# Altium project Parking_PCB.PrjPcb
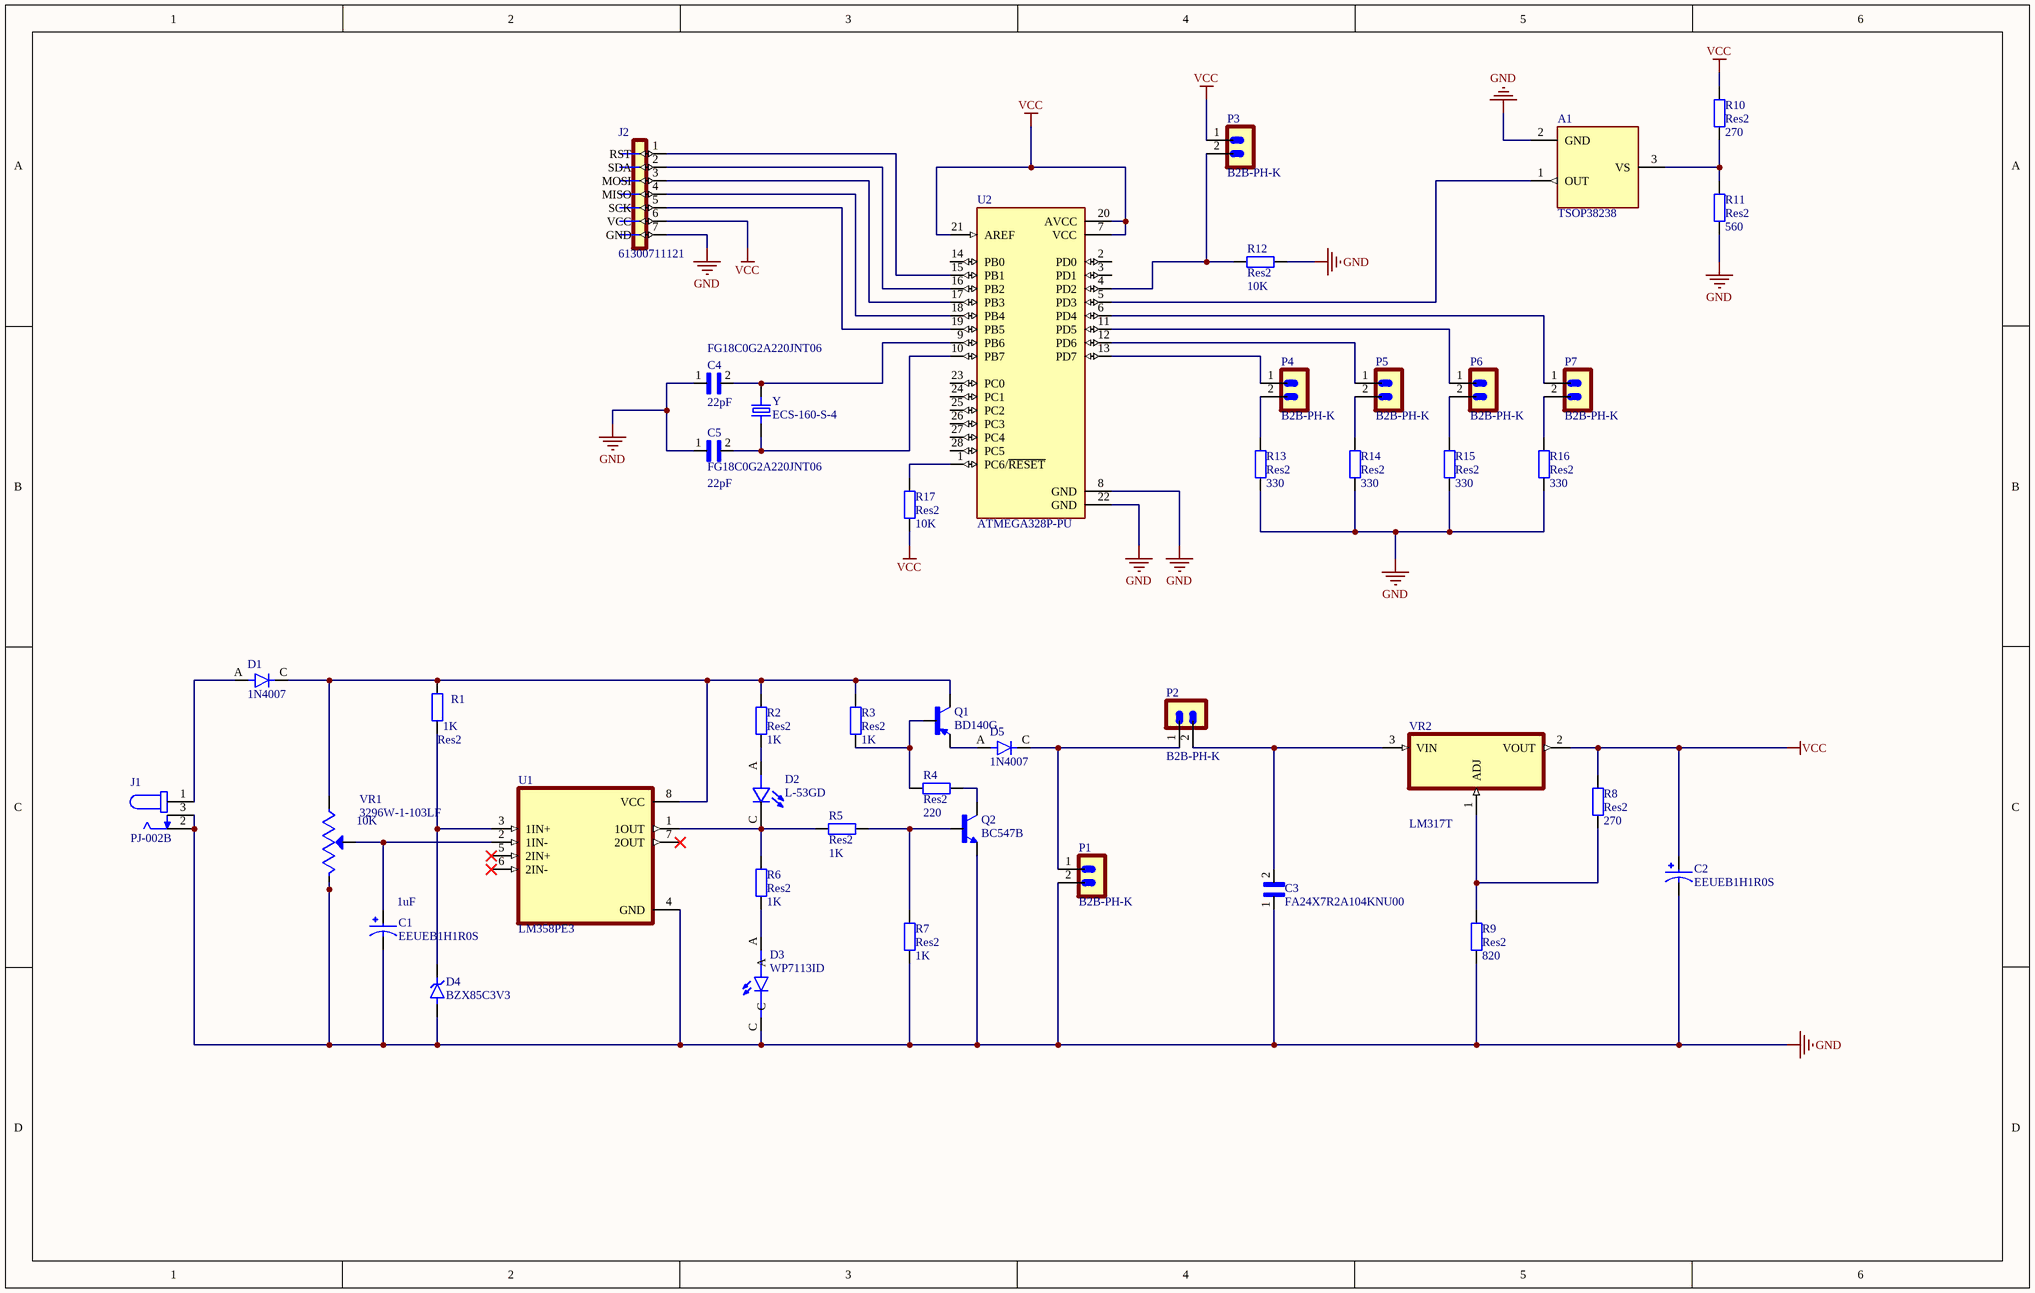
[diagram p0: Sheet1.SchDoc]
1 sheet, 44 parts. Net scope: global (net labels, ports and power ports of the same name join across sheets).
Board file: PCB2.PcbDoc

## Sheet Sheet1.SchDoc
size 381 x 241 mm; SheetNumber: 1; SheetTotal: 1; SPICEModelCacheBEMBTYLE: <root> / <DocumentId>BEMBTYLE</DocumentId> / </root>

### Parts
A1  TSOP38238  [XDCR_TSOP38238]
C1  EEUEB1H1R0S  value 1uF  [CAPPRD200W50D500H1100]
C2  EEUEB1H1R0S  [CAPPRD200W50D500H1100]
C3  FA24X7R2A104KNU00  [CAPRB500W50L450T300H550]
C4  FG18C0G2A220JNT06  value 22pF  [CAPRB250W50L400T250H550]
C5  FG18C0G2A220JNT06  value 22pF  [CAPRB250W50L400T250H550]
D1  1N4007  [DIOAD1060W80L520D270]
D2  L-53GD  [LEDRD254W50D500H1060]
D3  WP7113ID  [LED_WP7113ID]
D4  BZX85C3V3  [DIOAD1036W73L450D282]
D5  1N4007  [DIOAD1060W80L520D270]
J1  PJ-002B  [CUI_PJ-002B]
J2  61300711121  [1X07-PIN]
P1  B2B-PH-K  [B2B-PH-K]
P2  B2B-PH-K  [B2B-PH-K]
P3  B2B-PH-K  [B2B-PH-K]
P4  B2B-PH-K  [B2B-PH-K]
P5  B2B-PH-K  [B2B-PH-K]
P6  B2B-PH-K  [B2B-PH-K]
P7  B2B-PH-K  [B2B-PH-K]
Q1  BD140G  [TO245P780X300X1364-3]
Q2  BC547B  [TO92250P510H770-3]
R1  Res2  value 1K  [AXIAL-0.4]
R2  Res2  value 1K  [AXIAL-0.4]
R3  Res2  value 1K  [AXIAL-0.4]
R4  Res2  value 220  [AXIAL-0.4]
R5  Res2  value 1K  [AXIAL-0.4]
R6  Res2  value 1K  [AXIAL-0.4]
R7  Res2  value 1K  [AXIAL-0.4]
R8  Res2  value 270  [AXIAL-0.4]
R9  Res2  value 820  [AXIAL-0.4]
R10  Res2  value 270  [AXIAL-0.4]
R11  Res2  value 560  [AXIAL-0.4]
R12  Res2  value 10K  [AXIAL-0.4]
R13  Res2  value 330  [AXIAL-0.4]
R14  Res2  value 330  [AXIAL-0.4]
R15  Res2  value 330  [AXIAL-0.4]
R16  Res2  value 330  [AXIAL-0.4]
R17  Res2  value 10K  [AXIAL-0.4]
U1  LM358PE3  [DIP794W45P254L959H508Q8]
U2  ATMEGA328P-PU  [DIP794W46P254L2967H457Q28B]
VR1  3296W-1-103LF  value 10K  [TRIM_3296W-1-103LF]
VR2  LM317T  [TO254P1054X470X1955-3]
Y  ECS-160-S-4  [XTAL_ECS-160-20-4X]

### Nets
GND: A1.2(GND) C1.N C2.N C3.1 C4.1 C5.1 D3.C D4.A J1.2 J1.3 J2.7(GND) P1.2 Q2.3(E) R7.1 R9.1 R11.1 R12.2 R13.1 R14.1 R15.1 R16.1 U1.4(GND) U2.8(GND) U2.22(GND) VR1.3(CW)
VCC: C2.P J2.6(VCC) P3.1 R8.2 R10.2 R17.1 U2.7(VCC) U2.20(AVCC) U2.21(AREF) VR2.2(VOUT)
NetA1_1: A1.1(OUT) U2.5(PD3)
NetA1_3: A1.3(VS) R10.1 R11.2
NetC1_P: C1.P U1.2(1IN-) VR1.2(WIPER)
NetC3_2: C3.2 P2.2 VR2.3(VIN)
NetC4_2: C4.2 U2.9(PB6) Y.2
NetC5_2: C5.2 U2.10(PB7) Y.1
NetD1_A: D1.A J1.1
NetD1_C: D1.C Q1.2(C) R1.2 R2.2 R3.2 U1.8(VCC) VR1.1(CCW)
NetD2_A: D2.A R2.1
NetD2_C: D2.C R5.1 R6.2 U1.1(1OUT)
NetD3_A: D3.A R6.1
NetD4_C: D4.C(K) R1.1 U1.3(1IN+)
NetD5_A: D5.A Q1.1(E)
NetD5_C: D5.C P1.1 P2.1
NetJ2_1: J2.1(RST) U2.15(PB1)
NetJ2_2: J2.2(SDA) U2.16(PB2)
NetJ2_3: J2.3(MOSI) U2.17(PB3)
NetJ2_4: J2.4(MISO) U2.18(PB4)
NetJ2_5: J2.5(SCK) U2.19(PB5)
NetP3_2: P3.2 R12.1 U2.4(PD2)
NetP4_1: P4.1 U2.13(PD7)
NetP4_2: P4.2 R13.2
NetP5_1: P5.1 U2.12(PD6)
NetP5_2: P5.2 R14.2
NetP6_1: P6.1 U2.11(PD5)
NetP6_2: P6.2 R15.2
NetP7_1: P7.1 U2.6(PD4)
NetP7_2: P7.2 R16.2
NetQ1_3: Q1.3(B) R3.1 R4.2
NetQ2_1: Q2.1(C) R4.1
NetQ2_2: Q2.2(B) R5.2 R7.2
NetR8_1: R8.1 R9.2 VR2.1(ADJ)
NetR17_2: R17.2 U2.1(PC6/~{RESET})

Not connected (* = marked no-connect by the designer): U1 5(2IN+)* 6(2IN-)* 7(2OUT)*; U2 2(PD0) 3(PD1) 14(PB0) 23(PC0) 24(PC1) 25(PC2) 26(PC3) 27(PC4) 28(PC5)

### Library data of the parts
A1 = TSOP38238: Remote Receiver Sensor, 38.0kHz 45m; MF: Vishay; Package: None; DigiKey-Purchase-URL: https://snapeda.com/shop?store=DigiKey&id=45262; Price: None; MP: TSOP38238; Availability: Good; Value: *; Mouser-Purchase-URL: https://snapeda.com/shop?store=Mouser&id=45262; SnapEDA_Link: https://www.snapeda.com/parts/TSOP38238/Vishay%20Semiconductor%20Opto%20Division/view-part/45262/?ref=snap
C1 C2 = EEUEB1H1R0S: CAP ALUM 1UF 20% 50V RADIAL; MF: Panasonic; MP: EEUEB1H1R0S; Package: RADIAL-2 Panasonic; Availability: Not in stock; Price: None; SnapEDA_Link: https://www.snapeda.com/parts/EEUEB1H1R0S/Panasonic/view-part/5782839/?ref=snap; Check_prices: https://www.snapeda.com/parts/EEUEB1H1R0S/Panasonic/view-part/5782839/?ref=eda
  C1: Parameter 1: *
  C2: Value: *
C3 = FA24X7R2A104KNU00: 0.1 µF ±10% 100V Ceramic Capacitor X7R Radial; MF: TDK; Value: 0.1uF; SnapEDA_Link: https://www.snapeda.com/parts/FA24X7R2A104KNU00/TDK/view-part/?ref=snap; Availability: In Stock; Purchase-URL: https://pricing.snapeda.com/search/part/FA24X7R2A104KNU00/?ref=eda; Check_prices: https://www.snapeda.com/parts/FA24X7R2A104KNU00/TDK/view-part/?ref=eda; Package: Radial TDK; MP: FA24X7R2A104KNU00; Price: None
C4 C5 = FG18C0G2A220JNT06: Cap Ceramic 22pF 100V C0G 5% Radial 2.5mm 125Â°C Ammo; MF: TDK; Purchase-URL: https://pricing.snapeda.com/search/part/FG18C0G2A220JNT06/?ref=eda; Check_prices: https://www.snapeda.com/parts/FG18C0G2A220JNT06/TDK/view-part/?ref=eda; Package: Radial TDK Corporation; MP: FG18C0G2A220JNT06; SnapEDA_Link: https://www.snapeda.com/parts/FG18C0G2A220JNT06/TDK/view-part/?ref=snap; Digi-Key_Part_Number: 445-173230-1-ND
D1 D5 = 1N4007: Diode Standard 1000 V 1A Through Hole DO-41; MF: NTE Electronics, Inc.; Package: DO-41 NTE Electronics; Check_prices: https://www.snapeda.com/parts/1N4007/NTE+Electronics/view-part/?ref=eda; Value: *; Purchase-URL: https://pricing.snapeda.com/search/part/1N4007/?ref=eda; Availability: In Stock; SnapEDA_Link: https://www.snapeda.com/parts/1N4007/NTE+Electronics/view-part/?ref=snap; MP: 1N4007; Price: None
D2 = L-53GD: LED 5mm Green 568nm 20mcd/10mA 60Â°; MF: Kingbright; Value: *; Package: CDIP-28; Check_prices: https://www.snapeda.com/parts/L-53GD/Kingbright/view-part/?ref=eda; MP: L-53GD; Price: None; SnapEDA_Link: https://www.snapeda.com/parts/L-53GD/Kingbright/view-part/?ref=snap; Availability: Unavailable
D3 = WP7113ID: Red 617nm LED Indication - Discrete 2V Radial; MF: Kingbright; Price: None; MP: WP7113ID; Package: Radial Kingbright; Check_prices: https://www.snapeda.com/parts/WP7113ID/Kingbright/view-part/?ref=eda; Purchase-URL: https://pricing.snapeda.com/search/part/WP7113ID/?ref=eda; Availability: In Stock; Value: *; SnapEDA_Link: https://www.snapeda.com/parts/WP7113ID/Kingbright/view-part/?ref=snap
J1 = PJ-002B: 2.5 x 6.5 mm, 2.5 A, Horizontal, Through Hole, Dc Power Jack Connector; MF: CUI Devices; SnapEDA_Link: https://www.snapeda.com/parts/PJ-002B/CUI+Devices/view-part/?ref=snap; Package: None; MP: PJ-002B; CUI_purchase_URL: https://www.cuidevices.com/product/interconnect/connectors/dc-power-connectors/jacks/pj-002b?utm_source=snapeda.com&utm_medium=referral&utm_campaign=snapedaBOM; Check_prices: https://www.snapeda.com/parts/PJ-002B/CUI+Devices/view-part/?ref=eda; Purchase-URL: https://pricing.snapeda.com/search/part/PJ-002B/?ref=eda; Price: None; Value: *; Availability: In Stock
J2 = 61300711121: Connector Header Through Hole 7 position 0.100 (2.54mm); MF: Wurth Elektronik; Package: None; Price: None; Value: *; SnapEDA_Link: https://www.snapeda.com/parts/61300711121/Wurth+Elektronik/view-part/?ref=snap; MP: 61300711121; Availability: In Stock; Check_prices: https://www.snapeda.com/parts/61300711121/Wurth+Elektronik/view-part/?ref=eda
P1-P7 = B2B-PH-K: Conn Shrouded Header HDR 2 POS 2mm Solder ST Thru-Hole Box; MF: JST Corporation; Value: *; SnapEDA_Link: https://www.snapeda.com/parts/B2B-PH-K/JST/view-part/?ref=snap; Purchase-URL: https://pricing.snapeda.com/search/part/B2B-PH-K/?ref=eda; Availability: In Stock; Price: None; Package: None; Check_prices: https://www.snapeda.com/parts/B2B-PH-K/JST/view-part/?ref=eda; MP: B2B-PH-K
Q1 = BD140G: Bipolar (BJT) Transistor PNP 80 V 1.5 A - 1.25 W Through Hole TO-126; MF: ON Semiconductor; Availability: In Stock; Purchase-URL: https://pricing.snapeda.com/search/part/BD140G/?ref=eda; Package: TO-225-3 ON Semiconductor; Check_prices: https://www.snapeda.com/parts/BD140G/Onsemi/view-part/?ref=eda; SnapEDA_Link: https://www.snapeda.com/parts/BD140G/Onsemi/view-part/?ref=snap; MP: BD140G; Price: None; Value: *
Q2 = BC547B: Bipolar (BJT) TransistÃ¶r NPN 45 V 100 mA 300MHz 625 mW Delikten TO-92 (TO-226); MF: ON Semiconductor; SnapEDA_Link: https://www.snapeda.com/parts/BC547B/Onsemi/view-part/?ref=snap; MP: BC547B; Availability: In Stock; Price: None; Value: *; Check_prices: https://www.snapeda.com/parts/BC547B/Onsemi/view-part/?ref=eda; Package: TO-92-3 ON Semiconductor; Purchase-URL: https://pricing.snapeda.com/search/part/BC547B/?ref=eda
R1-R17 = Res2: Resistor; Published: 8-Jun-2000; LatestRevisionDate: 17-Jul-2002; LatestRevisionNote: Re-released for DXP Platform.; PackageReference: AXIAL-0.4; Publisher: Altium Limited; PackageDescription: Axial Device, Thru-Hole; 2 Leads; 0.4 in Pin Spacing
U2 = ATMEGA328P-PU: ATmega Series 20 MHz 32 KB Flash 2 KB SRAM 8-Bit Microcontroller - DIP-28; MP: ATMEGA328P-PU; Package: None; Availability: Unavailable; Price: None; Value: *
VR1 = 3296W-1-103LF: 10 kOhms 0.5W, 1/2W PC Pins Through Hole Trimmer Potentiometer Cermet 25.0 Turn Top Adjustment; MF: Bourns; SnapEDA_Link: https://www.snapeda.com/parts/3296W-1-103LF/Bourns/view-part/?ref=snap; MP: 3296W-1-103LF; Price: None; Package: SOT-23-5 Bourns; Check_prices: https://www.snapeda.com/parts/3296W-1-103LF/Bourns/view-part/?ref=eda; Purchase-URL: https://pricing.snapeda.com/search/part/3296W-1-103LF/?ref=eda; Availability: In Stock
VR2 = LM317T: 1.5-A, 40-V, adjustable linear voltage regulator 3-TO-220; MF: Texas Instruments; Price: None; Availability: In Stock; Package: TO-220-3 Texas Instruments; MP: LM317T; Value: *; SnapEDA_Link: https://www.snapeda.com/parts/LM317T/Texas+Instruments/view-part/?ref=snap; Purchase-URL: https://pricing.snapeda.com/search/part/LM317T/?ref=eda; Check_prices: https://www.snapeda.com/parts/LM317T/Texas+Instruments/view-part/?ref=eda
Y = ECS-160-S-4: 16MHz Â±30ppm Crystal Series 40 Ohms HC-49/US; MF: ECS Inc.; SnapEDA_Link: https://www.snapeda.com/parts/ECS-160-S-4/ECS%20Inc./view-part/3657575/?ref=snap; Value: *; Availability: Unavailable; Price: None; MP: ECS-160-S-4; Package: HC49/US ECS International
D4 = BZX85C3V3: MP: BZX85C3V3; Availability: Unavailable; Price: None; Value: *; Package: None
U1 = LM358PE3: Value: *; MP: LM358PE3; Package: None; Availability: Unavailable; Price: None